# EAGLE design Сирена (EAGLE 9.1.3)
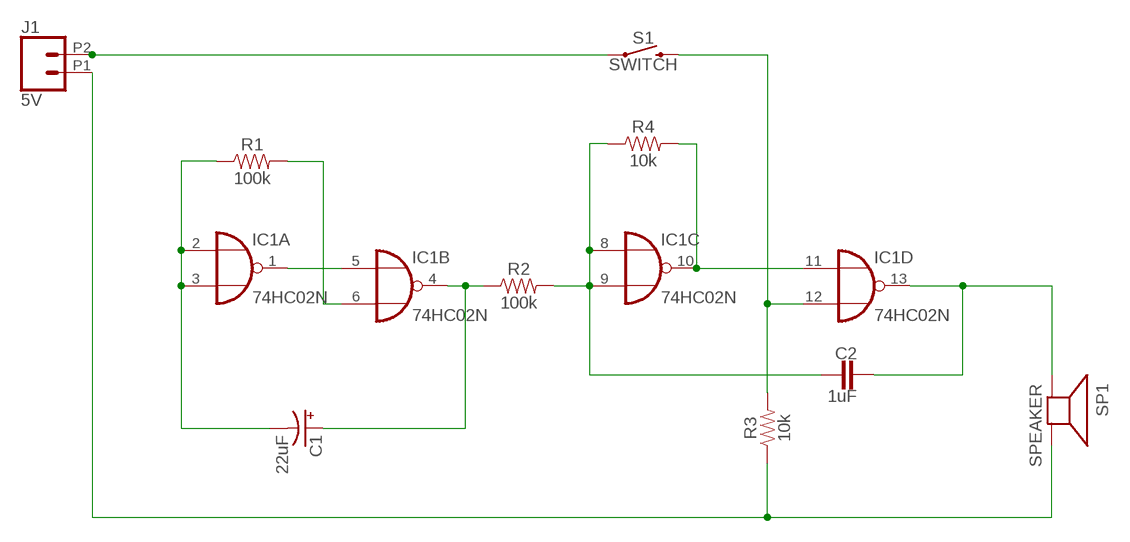
[diagram p0: schematic, sheet 1]

## Parts
C1  22uF  10UF-POLAR-RADIAL-2.5MM-25V-20%  [CPOL-RADIAL-2.5MM-5MM]
C2  1uF  0.1UF-KIT-EZ-50V-20%  [CAP-PTH-SMALL-KIT]
IC1  74HC02N  [DIL14]
J1  5V  CONN_022.54MM_SCREWTERM  [1X02_2.54_SCREWTERM]
R1  100k  10KOHM-HORIZ-1/4W-5%  [AXIAL-0.3]
R2  100k  10KOHM-HORIZ-1/4W-5%  [AXIAL-0.3]
R3  10k  10KOHM-HORIZ-1/4W-5%  [AXIAL-0.3]
R4  10k  10KOHM-HORIZ-1/4W-5%  [AXIAL-0.3]
S1  SWITCH  MOMENTARY-SWITCH-SPST-PTH-6.0MM  [TACTILE_SWITCH_PTH_6.0MM]
SP1  SPEAKER  SPEAKER/PS12  [PS12]

## Nets
5V: IC1.12(D:I1) R3.P$2 S1.3
GND: J1.P1 R3.P$1 SP1.P$2(-)
N$1: C1.2(-) IC1.2(A:I0) IC1.3(A:I1) R1.P$1
N$2: IC1.1(A:O) IC1.5(B:I0)
N$3: IC1.6(B:I1) R1.P$2
N$4: C1.1(+) IC1.4(B:O) R2.P$1
N$6: C2.2 IC1.8(C:I0) IC1.9(C:I1) R2.P$2 R4.P$1
N$7: IC1.10(C:O) IC1.11(D:I0) R4.P$2
N$10: C2.1 IC1.13(D:O) SP1.P$1(+)
VCC: J1.P2 S1.1

## Power pins joined to a net without a drawn wire
GND: IC1.7(P:GND)
VCC: IC1.14(P:VCC)

## Library data of the parts
C1 = SparkFun-Capacitors:10UF-POLAR: 10.0µF polarized capacitors A capacitor is a passive two-terminal electrical component used to store electrical energy temporarily in an electric field.; PROD_ID: CAP-08440; VALUE: 10uF
C2 = SparkFun-Capacitors:0.1UF: 0.1µF ceramic capacitors A capacitor is a passive two-terminal electrical component used to store electrical energy temporarily in an electric field.; PROD_ID: CAP-08370; VALUE: 0.1uF
IC1 = 74xx-eu:74*02: Quad 2-input NOR gate
J1 = SparkFun-Connectors:CONN_02: Multi connection point. Often used as Generic Header-pin footprint for 0.1 inch spaced/style header connections On any of the 0.1 inch spaced packages, you can populate with these: Break Away Headers - Straight <https://www.sparkfun.com/products/116> (PRT-00116) Break Away Male Headers - Right Angle <https://www.sparkfun.com/products/553> (PRT-00553) Female Headers <https://www.sparkfun.com/products/115> (PRT-00115) Break Away Headers - Machine Pin <https://www.sparkfun.com/products/117> (PRT-00117) Break Away Female Headers - Swiss Machine Pin <https://www.sparkfun.com/products/743> (PRT-00743) For SCREWTERMINALS and SPRING TERMINALS visit here: Screw Terimnals on SparkFun.com <https://www.sparkfun.com/search/results?term=Screw+Terminals> (5mm/3.5mm/2.54mm spacing) This device is also useful as a general connection point to wire up your design to another part of your project. Our various solder wires solder well into these plated through hole pads. Hook-Up Wire - Assortment (Stranded, 22 AWG) <https://www.sparkfun.com/products/11375> (PRT-11375) Hook-Up Wire - Assortment (Solid Core, 22 AWG) <https://www.sparkfun.com/products/11367> (PRT-11367) View the entire wire category on our website here <https://www.sparkfun.com/categories/141> Special notes: Molex polarized connector foot print use with: PRT-08233 with associated crimp pins and housings. 2.54_SCREWTERM for use with PRT-10571. 3.5mm Screw Terminal footprints for PRT-08084 5mm Screw Terminal footprints for use with PRT-08432
R1 R2 = SparkFun-Resistors:10KOHM: 10kΩ resistor A resistor is a passive two-terminal electrical component that implements electrical resistance as a circuit element. Resistors act to reduce current flow, and, at the same time, act to lower voltage levels within circuits. - Wikipedia; PROD_ID: RES-09435; VALUE: 10k
R3 R4 = SparkFun-Resistors:10KOHM: 10kΩ resistor A resistor is a passive two-terminal electrical component that implements electrical resistance as a circuit element. Resistors act to reduce current flow, and, at the same time, act to lower voltage levels within circuits. - Wikipedia; PROD_ID: RES-09435
S1 = SparkFun-Switches:MOMENTARY-SWITCH-SPST: Momentary Switch (Pushbutton) - SPST Normally-open (NO) SPST momentary switches (buttons, pushbuttons). Variants PTH-12MM - 12mm square, through-hole Momentary Pushbutton Switch - 12mm Square <https://www.sparkfun.com/products/9190> (COM-09190) PTH-6.0MM, PTH-6.0MM-KIT - 6.0mm square, through-hole Mini Pushbutton Switch <https://www.sparkfun.com/products/97> (COM-00097) KIT package intended for soldering kit's - only one side of pads' copper is exposed. PTH-RIGHT-ANGLE-KIT - Right-angle, through-hole Right Angle Tactile Button <https://www.sparkfun.com/products/10791> - Used on SparkFun BigTime Watch Kit <https://www.sparkfun.com/products/11734> SMD-12MM - 12mm square, surface-mount Tactile Button - SMD (12mm) <https://www.sparkfun.com/products/12993> (COM-12993) Used on SparkFun PicoBoard <https://www.sparkfun.com/products/11888> SMD-4.5MM - 4.5mm Square Trackball Switch Used on SparkFun Blackberry Trackballer Breakout <https://www.sparkfun.com/products/13169> SMD-4.6MMX2.8MM - 4.60mm x 2.80mm, surface mount Used on SparkFun SAMD21 Mini Breakout <https://www.sparkfun.com/products/13664> SMD-5.2MM, SMD-5.2-REDUNDANT - 5.2mm square, surface-mount Mini Pushbutton Switch - SMD <https://www.sparkfun.com/products/8720> (COM-08720) Used on Arduino Pro Mini <https://www.sparkfun.com/products/11114> REDUNDANT package connects both switch circuits together SMD-6.0X3.5MM - 6.0 x 3.5mm, surface mount Momentary Reset Switch SMD <https://www.sparkfun.com/products/8229> (COM-08229) SMD-6.2MM-TALL - 6.2mm square, surface mount Tactile Button - SMD (6mm) <https://www.sparkfun.com/products/12992> Used on SparkFun Digital Sandbox <https://www.sparkfun.com/products/12651> SMD-RIGHT-ANGLE - Right-angle, surface mount Used on SparkFun Block for Intel® Edison - Arduino <https://www.sparkfun.com/products/13036>; PROD_ID: SWCH-08441; SF_SKU: COM-00097
SP1 = adafruit:SPEAKER: SPEAKER Source: Buerklin Added PS12 (for part # PS1240 piezo) http://www.ladyada.net/library/pcb/eaglelibrary.html

## Net classes
0 default: width 0.61 mm

## Board
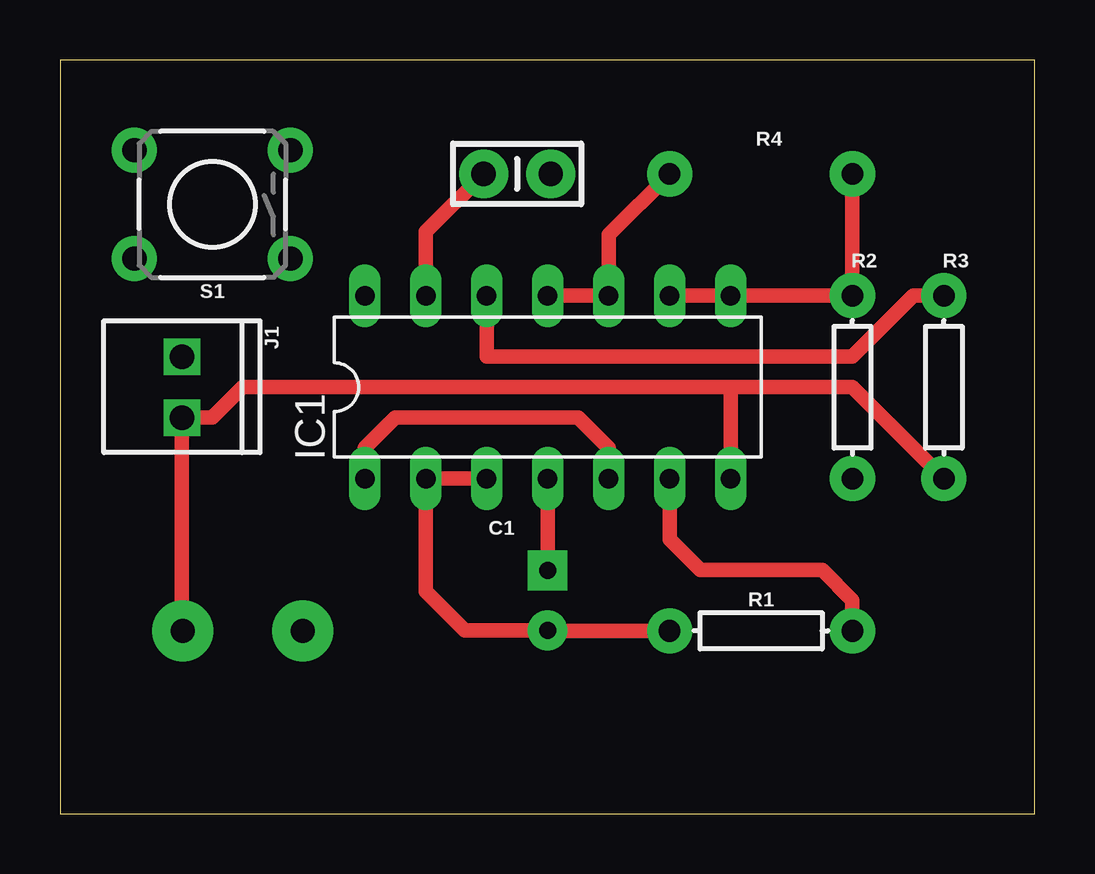
[diagram p1: board, top side]
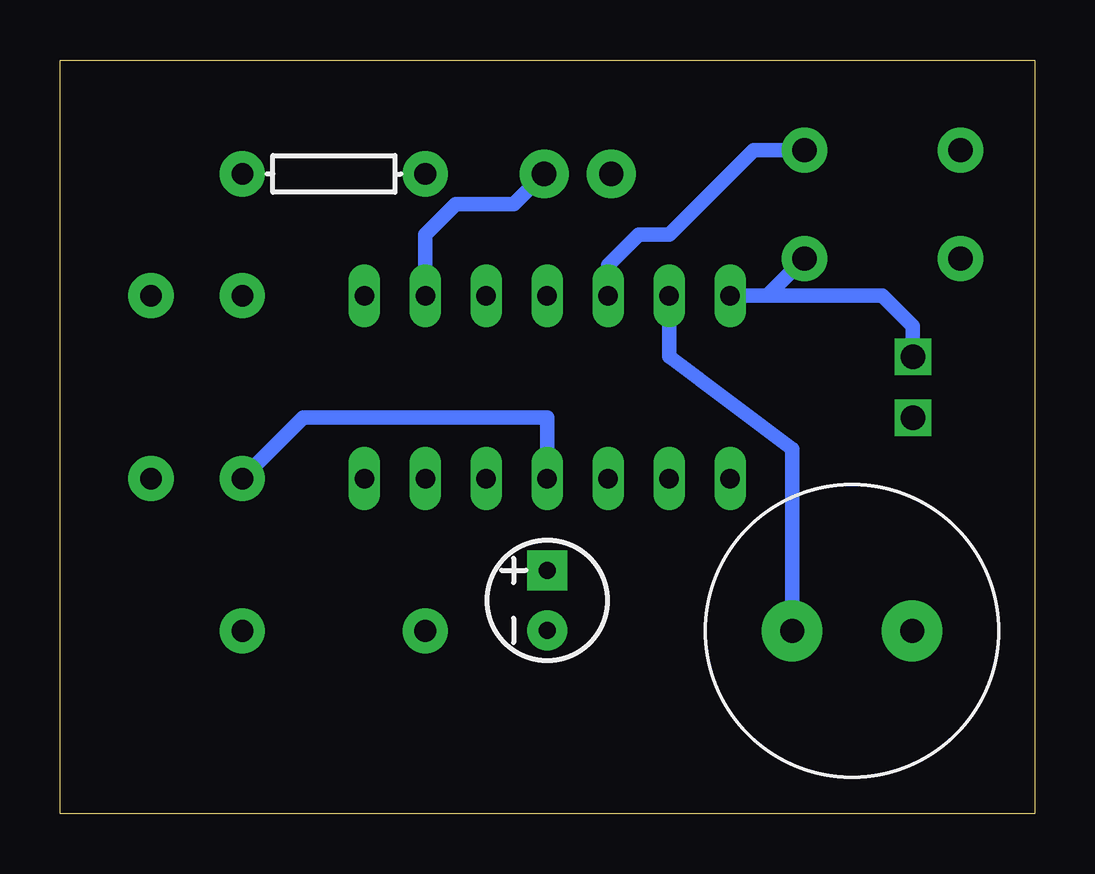
[diagram p2: board, bottom side, seen from below]

Size 40.62 x 31.42 mm. Coordinates in mm from the lower left corner, seen from the top.
Outline: 0,0 40.62,0 40.62,31.42 0,31.42 0,0
Copper layers (1*16): Top 0.035mm / dielectric 1.5mm / Bottom 0.035mm
Design rules "default": minimum track width 6mil, minimum drill 0.35mm, track to track 6mil, track to pad 6mil, pad to pad 6mil, via to via 6mil, smd to smd 6mil, copper to edge 40mil, drill to drill 6mil, minimum pad ring 10mil, minimum via ring 8mil, stop-mask expansion 4mil, vias tented up to drill 0mil, thermal gap 10mil

### Footprints (pad centres in the part's own frame; a part is rotated, then mirrored left to right if it is on the bottom)
CPOL-RADIAL-2.5MM-5MM = drill 0.7 pad 1.651 square: 1 1.25,0 | drill 0.7 pad 1.651: 2 -1.25,0
CAP-PTH-SMALL-KIT = drill 1.016 pad 2.032: 1 -1.397,0; 2 1.397,0
DIL14 = drill 0.813 long: 1 -7.62,-3.81; 2 -5.08,-3.81; 3 -2.54,-3.81; 4 0,-3.81; 5 2.54,-3.81; 6 5.08,-3.81; 7 7.62,-3.81; 8 7.62,3.81; 9 5.08,3.81; 10 2.54,3.81; 11 0,3.81; 12 -2.54,3.81; 13 -5.08,3.81; 14 -7.62,3.81
1X02_2.54_SCREWTERM = drill 1.016 square: P1 2.54,0; P2 0,0
AXIAL-0.3 = drill 0.9 pad 1.88: P$1 -3.81,0; P$2 3.81,0
TACTILE_SWITCH_PTH_6.0MM = drill 1.016 pad 1.88: 1 -3.251,2.261; 2 3.251,2.261; 3 -3.251,-2.261; 4 3.251,-2.261
PS12 = drill 1 pad 2.54: P$1 -2.5,0; P$2 2.5,0

### Placement (x,y rotation side)
C1  20.32,8.89 90 bottom
C2  19.05,26.67 0 top
IC1  20.32,17.78 0 top
J1  5.08,19.05 270 top
R1  29.21,7.62 0 top
R2  33.02,17.78 90 top
R3  36.83,17.78 90 top
R4  29.21,26.67 0 bottom
S1  6.35,25.4 180 top
SP1  7.62,7.62 0 bottom

### Tracks (layer width: path | path; a pad name or v marks a point on that pad's centre or on a via)
5V
  Top 0.61: IC1.12 17.78,19.05 33.02,19.05 35.56,21.59 R3.P$2
  Bottom 0.61: S1.3 11.71,27.66 15.24,24.13 16.51,24.13 17.78,22.86 IC1.12
GND
  Top 0.406: 5.08,7.66 SP1.P$2
  Top 0.61: 5.08,7.66 J1.P1 6.35,16.51 7.62,17.78 27.94,17.78 | R3.P$1 33.02,17.78 27.94,17.78 | 27.94,17.78 27.94,16.51 IC1.7
N$1
  Top 0.406: C1.2 20.34,7.62
  Top 0.61: 20.34,7.62 R1.P$1 | IC1.3 IC1.2 15.24,11.43 15.24,9.26 16.86,7.64 C1.2
N$2
  Top 0.61: IC1.1 12.7,15.24 13.97,16.51 21.59,16.51 22.86,15.24 IC1.5
N$3
  Top 0.61: IC1.6 25.4,11.43 26.67,10.16 31.75,10.16 33.02,8.89 R1.P$2
N$4
  Top 0.61: C1.1 20.32,11.43 IC1.4
  Bottom 0.61: R2.P$1 30.48,16.51 20.32,16.51 IC1.4
N$6
  Top 0.61: R4.P$1 R2.P$2 IC1.8 IC1.9
  Bottom 0.61: C2.2 21.72,25.4 24.13,25.4 25.4,24.13 IC1.9
N$7
  Top 0.61: IC1.11 IC1.10 22.86,24.13 R4.P$2
N$10
  Top 0.61: C2.1 15.24,24.26 IC1.13
  Bottom 0.61: IC1.13 15.24,19.05 10.12,15.2 SP1.P$1
VCC
  Bottom 0.61: J1.P2 5.08,20.32 6.35,21.59 IC1.14 11.15,21.59 S1.1